# Altium schematic sheet Main.SchDoc: Main
size A4; ApprovedBy: Douglas Felipe; Author: Douglas Felipe; DocumentNumber: GERABS01; Revision: 1.0; SheetNumber: 1; SheetTotal: 5
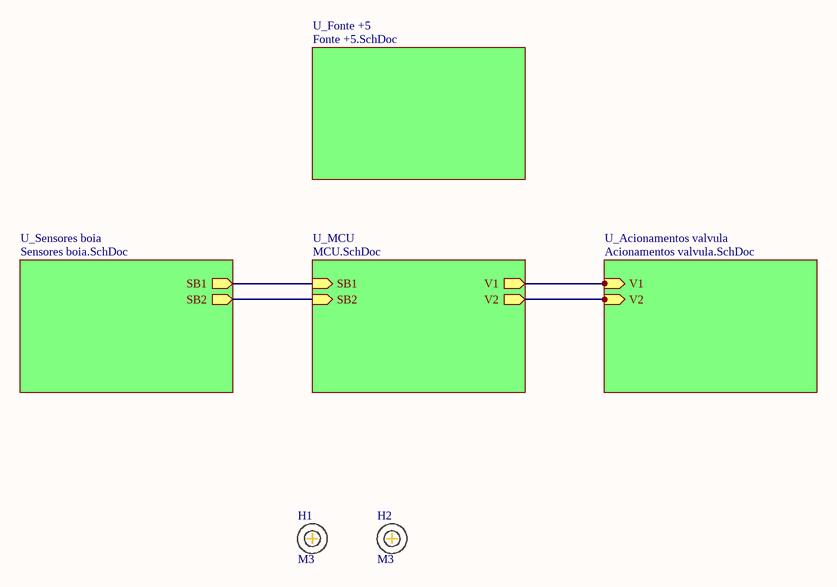
[diagram p0: Main.SchDoc]

## Parts
H1  M3  [Parafuso M2]
H2  M3  [Parafuso M2]

## Sub-sheets
U_Acionamentos valvula = Acionamentos valvula.SchDoc: V1 (in), V2 (in)
U_Fonte +5 = Fonte +5.SchDoc: no entries
U_MCU = MCU.SchDoc: SB1 (in), SB2 (in), V1 (out), V2 (out)
U_Sensores boia = Sensores boia.SchDoc: SB1 (out), SB2 (out)

## Nets
(unnamed): sheet U_Acionamentos valvula/V1, sheet U_MCU/V1
(unnamed): sheet U_Acionamentos valvula/V2, sheet U_MCU/V2
(unnamed): sheet U_MCU/SB1, sheet U_Sensores boia/SB1
(unnamed): sheet U_MCU/SB2, sheet U_Sensores boia/SB2

## Notes on the sheet
- PROJETO
- REV
- TITULO
- PÁG
- DE
- NÚMERO
- DESIGNER
- REVISADO POR
- DATA
- ARQUIVO
- TAMANHO
- A4

## Library data of the parts
H1 H2 = Furo M2